# Altium schematic sheet CurrentSenseAmpBias.SchDoc: Current Sense Amplifier Bias Voltage
size A; DrawnBy: Brent; DocumentNumber: XXXXXX; Revision: A; SheetNumber: 5; SheetTotal: 8
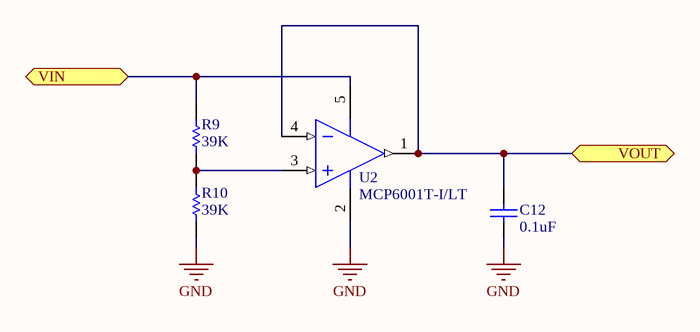
[diagram p0: CurrentSenseAmpBias.SchDoc]

## Parts
C12  0.1uF  [CAPC0603(1608)100_L]
R9  39K  [RESC0603(1608)_L]
R10  39K  [RESC0603(1608)_L]
U2  MCP6001T-I/LT  [SC70-LT5_M]

## Ports
VIN, VOUT

## Nets
GND: C12.1 R10.1 U2.2(VSS)
VIN: R9.2 U2.5(VDD) ; port VIN
VOUT: C12.2 U2.1(VOUT) U2.4(VIN-) ; port VOUT
NetR9_1: R9.1 R10.2 U2.3(VIN+)

## Library data of the parts
C12 = CMP-1035-02595-1: CAP 100nF 100V ±10% 0603 (1608 Metric) Thickness 1mm SMD; Tolerance: Â±10%; Case-EIA: 0603; Case-Metric: 1608; Rated Voltage: 100 V; Value: 100nF; Technology: SMT; Max Thickness: 1 mm
R9 R10 = CMP-1012-00689-1: 39K 0.1W 1% 0603 (1608 Metric)  SMD; Case-Metric: 1608; Case-EIA: 0603; Value: 39000.00 Ohm; Technology: SMT; Tolerance: 1 %; Power: 0.1 W
U2 = CMP-0187-00457-2: 1 MHz, Low-Power Operational Amplifier, 5-Pin SC-70, Industrial Temperature, Tape and Reel; RevisionNote: URLs added.; ComponentLink2Description: Datasheet; ComponentLink3URL: http://www.microchip.com/stellent/groups/techpub_sg/documents/packagingspec/en012702.pdf; PackageReference: SC70-LT5; PackageDescription: 5-Lead Plastic Small Outline Transistor (LT) [SC70]; ComponentLink2URL: http://ww1.microchip.com/downloads/en/DeviceDoc/21733j.pdf; ComponentLink3Description: Package Specification; PackageVersion: revBB, Aug-2009; ComponentLink1Description: Manufacturer URL; DatasheetVersion: revJ, Nov-2009; ComponentLink1URL: http://www.microchip.com/; Code_IPC: SOT353-5